# EAGLE design Motor_Driver (EAGLE 9.5.2)
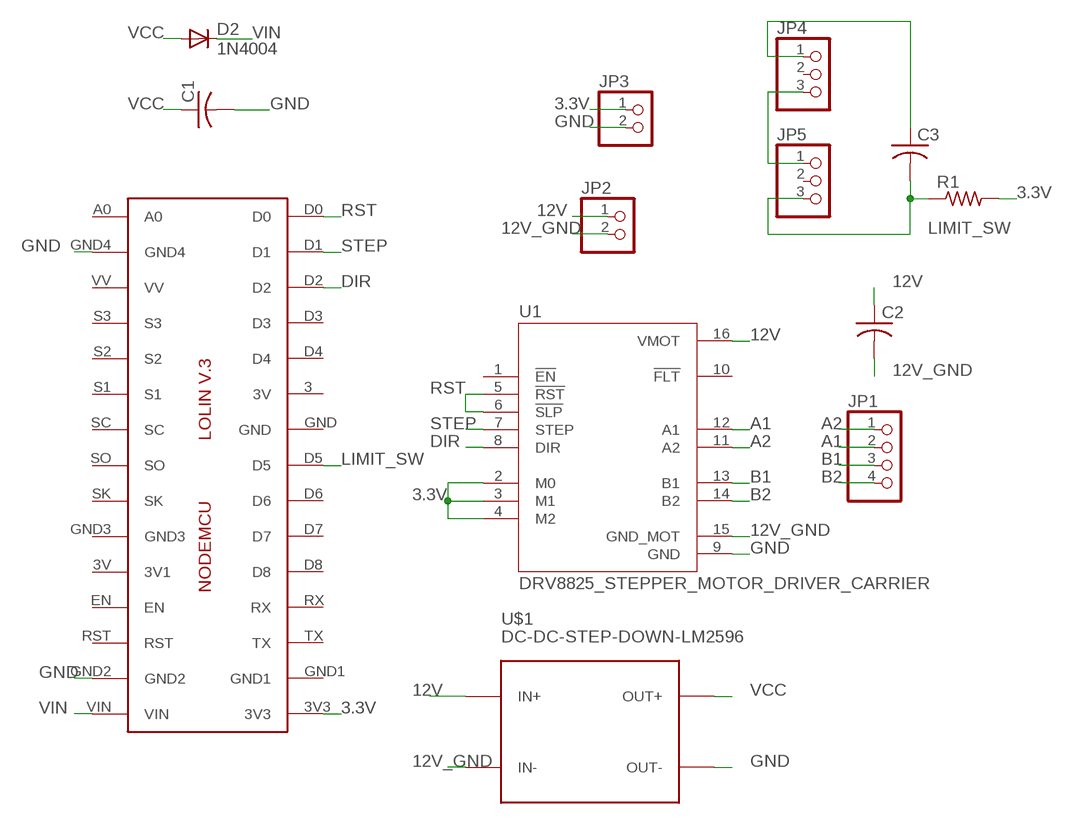
[diagram p0: schematic, sheet 1]

## Parts
C1  C-US025-040X050  [C025-040X050]
C2  C-US050-035X075  [C050-035X075]
C3  C-US050-035X075  [C050-035X075]
D2  1N4004  [DO41-10]
IC1  LOLINV3  [LOLINV3]
JP1  PINHD-1X4  [1X04]
JP2  PINHD-1X2  [1X02]
JP3  PINHD-1X2  [1X02]
JP4  PINHD-1X3CB  [1X03-CLEANBIG]
JP5  PINHD-1X3CB  [1X03-CLEANBIG]
R1  R-US_V234/12  [V234/12]
U1  DRV8825_STEPPER_MOTOR_DRIVER_CARRIER  [IC_DRV8825_STEPPER_MOTOR_DRIVER_CARRIER]
U$1  DC-DC-STEP-DOWN-LM2596  [DC-DC-STEP-DOWN-LM2596]

## Nets
3.3V: IC1.3V3 JP3.1 R1.2 U1.2(M0) U1.3(M1) U1.4(M2)
12V: C2.1 JP2.1 U1.16(VMOT) U$1.IN+
12V_GND: C2.2 JP2.2 U1.15(GND_MOT) U$1.IN-
A1: JP1.2 U1.12(A1)
A2: JP1.1 U1.11(A2)
B1: JP1.3 U1.13(B1)
B2: JP1.4 U1.14(B2)
DIR: IC1.D2 U1.8(DIR)
GND: C1.2 IC1.GND2 IC1.GND4 JP3.2 U1.9(GND) U$1.OUT-
LIMIT_SW: C3.2 IC1.D5 JP5.3 R1.1
N$1: JP4.3 JP5.1
N$2: C3.1 JP4.1
RST: IC1.D0 U1.5(!RST) U1.6(!SLP)
STEP: IC1.D1 U1.7(STEP)
VCC: C1.1 D2.A U$1.OUT+
VIN: D2.C IC1.VIN
Unconnected: IC1.3(3V) IC1.3V(3V1) IC1.A0 IC1.D3 IC1.D4 IC1.D6 IC1.D7 IC1.D8 IC1.EN IC1.GND IC1.GND1 IC1.GND3 IC1.RST IC1.RX IC1.S1 IC1.S2 IC1.S3 IC1.SC IC1.SK IC1.SO IC1.TX IC1.VV JP4.2 JP5.2 U1.1(!EN) U1.10(!FLT)

## Library data of the parts
C1-C3 = adafruit:C-US: CAPACITOR, American symbol
D2 = adafruit:1N4004: DIODE General purpose 1N400x type rectifier (With bigger pads) http://www.ladyada.net/library/pcb/eaglelibrary.html
IC1 = Lolin:LOLINV3
JP1 = pinhead:PINHD-1X4: PIN HEADER
JP2 JP3 = pinhead:PINHD-1X2: PIN HEADER
JP4 JP5 = adafruit:PINHD-1X3: PIN HEADER
R1 = adafruit:R-US_: RESISTOR, American symbol
U1 = DRV8825:DRV8825_STEPPER_MOTOR_DRIVER_CARRIER: Stepper motor controler; IC: DRV8825; 1.5A; Uin mot: 8.2÷45V; AVAILABILITY: Unavailable; DESCRIPTION: DRV8825 Motor Controller/Driver Power Management Evaluation Board; MF: Pololu; MP: DRV8825 STEPPER MOTOR DRIVER CARRIER; PACKAGE: None; PRICE: None
U$1 = diy-modules:DC-DC-STEP-DOWN-LM2596: DC/DC Step-Down Regulator based on LM2596-ADJ chip LM2596 datasheet available here: http://www.ti.com/lit/ds/symlink/lm2596.pdf Click here to find device on ebay.com <http://www.ebay.com/sch/lm2596+power+regulator>

## Board
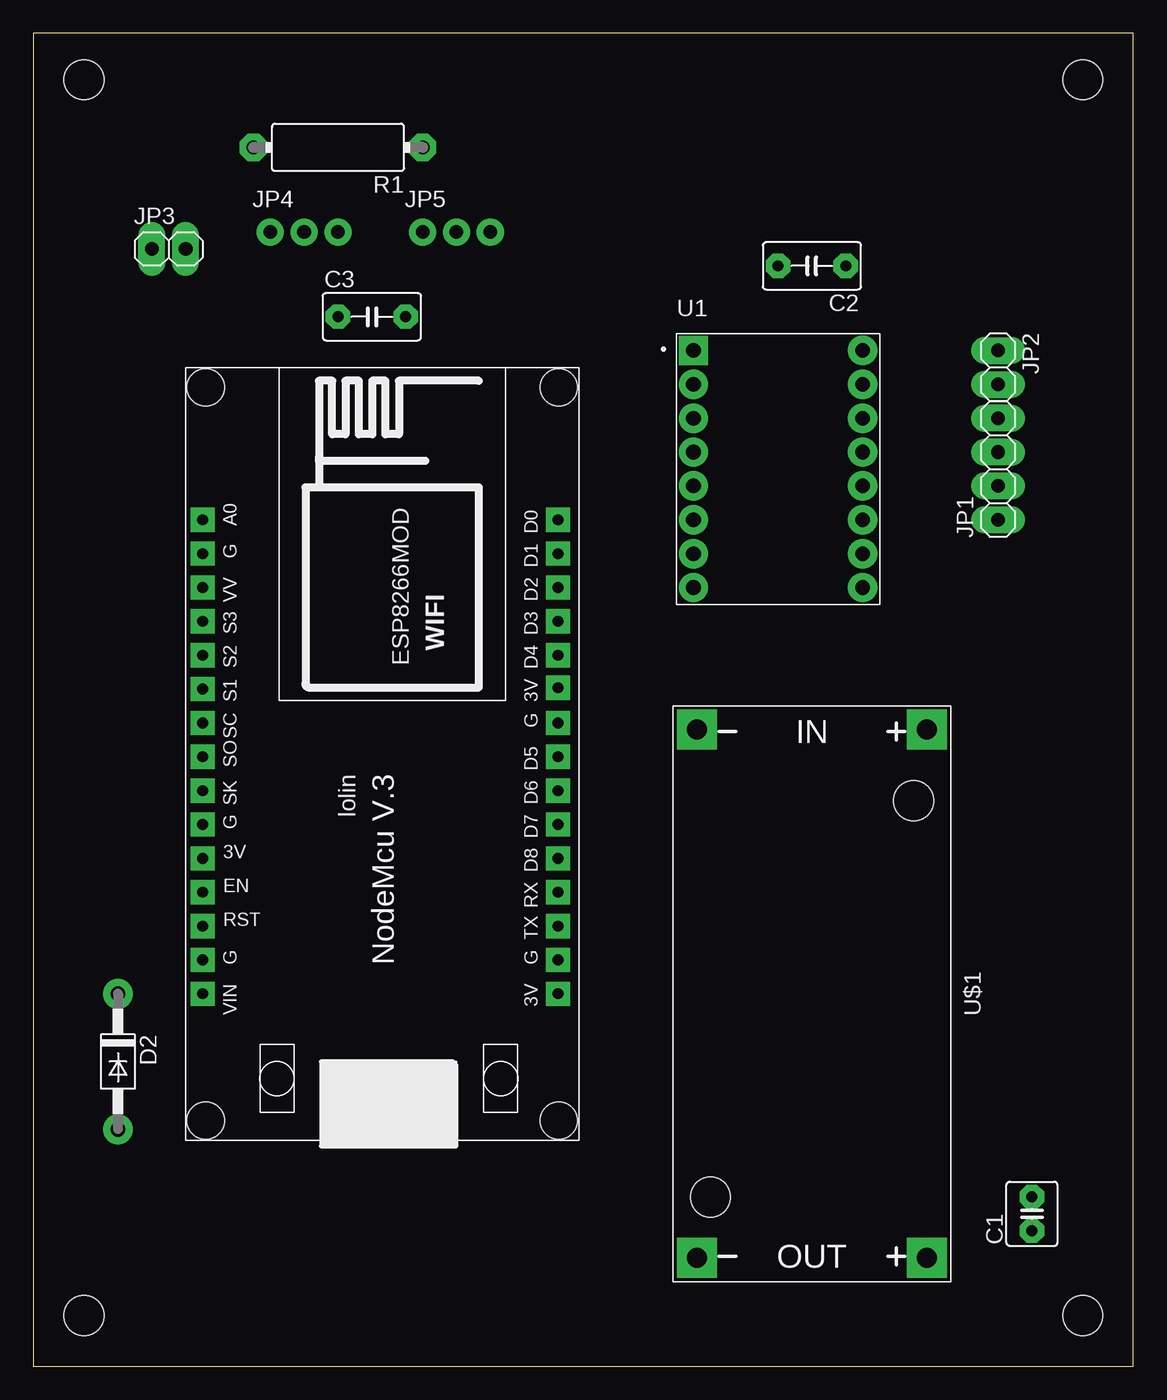
[diagram p1: board, top side]
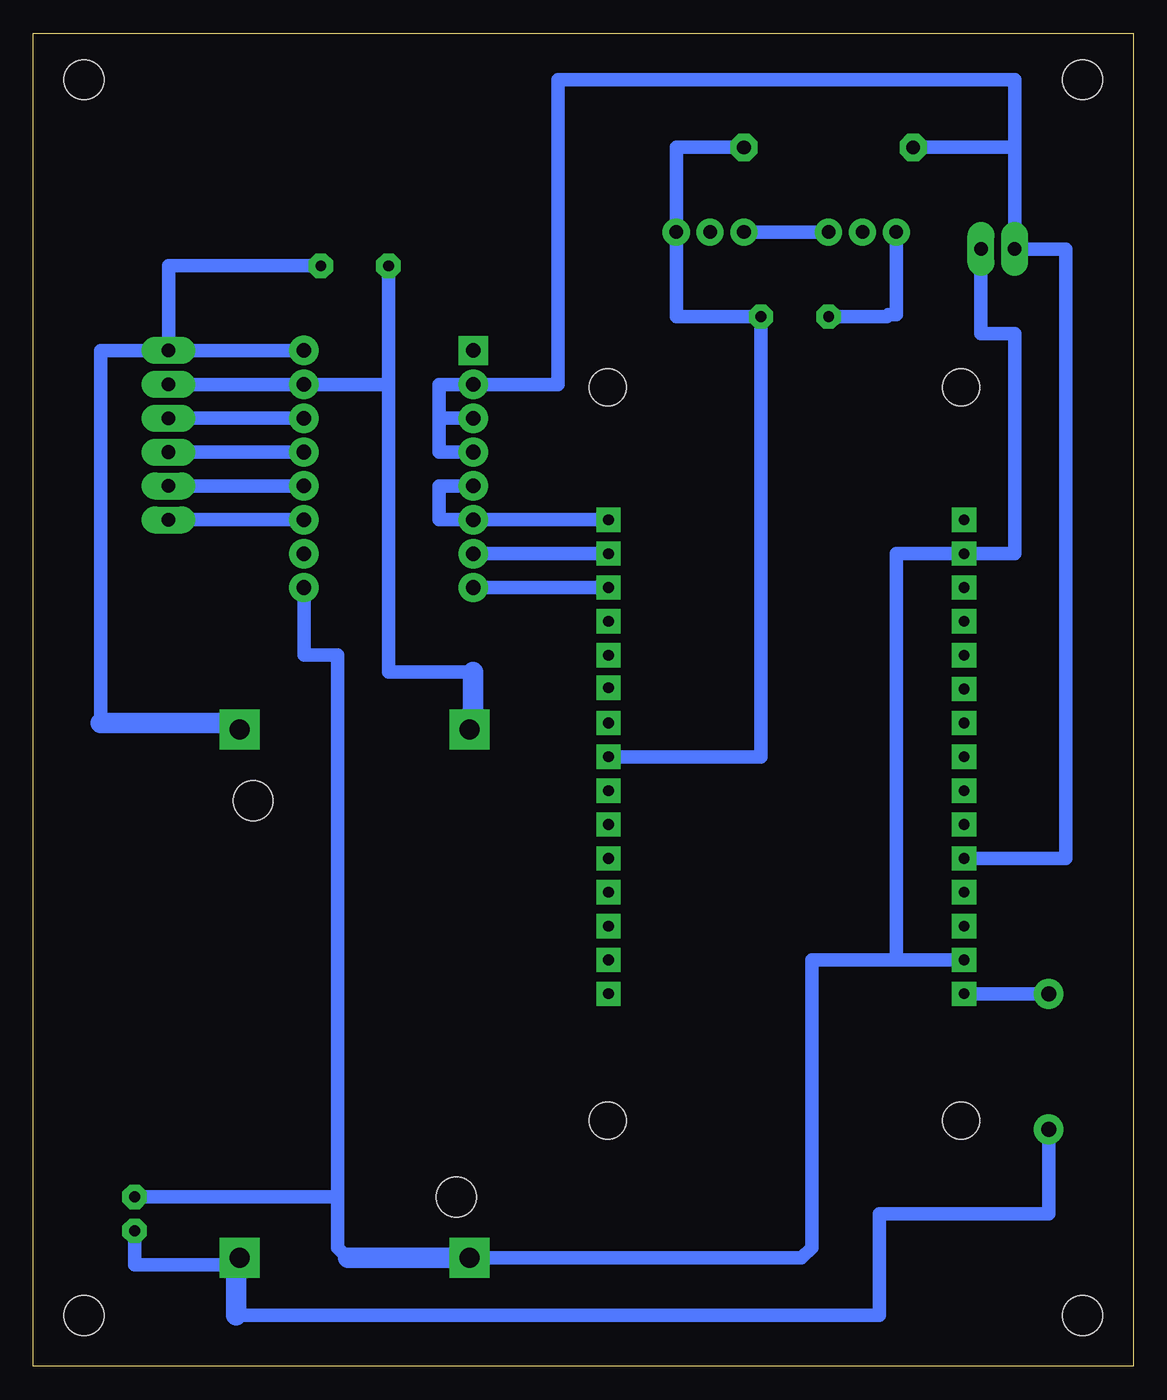
[diagram p2: board, bottom side, seen from below]

Size 82.53 x 100 mm. Coordinates in mm from the lower left corner, seen from the top.
Outline: 0,0 82.53,0 82.53,100 0,100 0,0
Copper layers (1*16): Top 0.035mm / dielectric 1.5mm / Bottom 0.035mm
Design rules "Old": minimum track width 1mm, minimum drill 1mm, track to track 16mil, track to pad 16mil, pad to pad 16mil, via to via 16mil, smd to smd 6mil, copper to edge 30mil, drill to drill 6mil, minimum pad ring 20mil, minimum via ring 8mil, stop-mask expansion 4mil, vias tented up to drill 0mil, thermal gap 10mil
Holes 3 mm at 3.81,96.52 78.74,96.52 3.81,3.81 78.74,3.81

### Footprints (pad centres in the part's own frame; a part is rotated, then mirrored left to right if it is on the bottom)
C025-040X050 = drill 0.813 pad 1.422 octagon: 1 -1.27,0; 2 1.27,0
C050-035X075 = drill 0.813 octagon: 1 -2.54,0; 2 2.54,0
DO41-10 = drill 1.118 pad 1.93: A 5.08,0; C -5.08,0
LOLINV3 = drill 0.8 pad 1.778 square: 3 24.03,27.94; 3V 46.99,27.94; 3V3 36.83,1.27; A0 11.43,1.27; D0 11.43,27.94; D1 13.97,27.94; D2 16.51,27.94; D3 19.05,27.94; D4 21.59,27.94; D5 29.21,27.94; D6 31.75,27.94; D7 34.29,27.94; D8 36.83,27.94; EN 39.37,1.27; GND 26.67,27.94; GND1 44.45,27.94; GND2 44.45,1.27; GND3 34.29,1.27; GND4 13.97,1.27; RST 41.91,1.27; RX 39.37,27.94; S1 24.13,1.27; S2 21.59,1.27; S3 19.05,1.27; SC 26.67,1.27; SK 31.75,1.27; SO 29.21,1.27; TX 41.91,27.94; VIN 46.99,1.27; VV 16.51,1.27 | hole 2.8: 56.5,28; 56.5,1.5; 1.5,1.5; 1.5,28
1X04 = drill 1.016 long: 1 -3.81,0; 2 -1.27,0; 3 1.27,0; 4 3.81,0
1X02 = drill 1.016 long: 1 -1.27,0; 2 1.27,0
1X03-CLEANBIG = drill 1.016 pad 1.676: 1 -2.54,0; 2 0,0; 3 2.54,0
V234/12 = drill 1.016 octagon: 1 -6.35,0; 2 6.35,0
IC_DRV8825_STEPPER_MOTOR_DRIVER_CARRIER = drill 1.1 square: 1 -6.35,8.89 | drill 1.1: 2 -6.35,6.35; 3 -6.35,3.81; 4 -6.35,1.27; 5 -6.35,-1.27; 6 -6.35,-3.81; 7 -6.35,-6.35; 8 -6.35,-8.89; 9 6.35,-8.89; 10 6.35,-6.35; 11 6.35,-3.81; 12 6.35,-1.27; 13 6.35,1.27; 14 6.35,3.81; 15 6.35,6.35; 16 6.35,8.89
DC-DC-STEP-DOWN-LM2596 = drill 1.5 pad 2.5 square: IN+ -19.812,8.636; IN- -19.812,-8.636; OUT+ 19.812,8.636; OUT- 19.812,-8.636 | hole 3: -14.478,7.62; 15.24,-7.62

### Placement (x,y rotation side)
C1  74.93,11.43 90 top
C2  58.42,82.55 180 top
C3  25.4,78.74 0 top
D2  6.35,22.86 270 top
IC1  11.43,74.93 270 top
JP1  72.39,67.31 90 top
JP2  72.39,74.93 270 top
JP3  10.16,83.82 0 top
JP4  20.32,85.09 0 top
JP5  31.75,85.09 0 top
R1  22.86,91.44 180 top
U1  55.88,67.31 0 top
U$1  58.42,27.94 270 top

### Tracks (layer width: path | path; a pad name or v marks a point on that pad's centre or on a via)
3.3V
  Bottom 1: 52.07,71.12 52.07,73.66 U1.2 43.18,73.66 43.18,96.52 8.89,96.52 8.89,91.44 | 52.07,71.12 U1.3 | 52.07,71.12 52.07,68.58 U1.4 | IC1.3V3 5.08,38.1 5.08,83.82 JP3.1 8.89,91.44 | 8.89,91.44 R1.2
12V
  Bottom 1: U1.16 JP2.1 | C2.1 72.39,82.55 JP2.1 | JP2.1 77.47,76.2 77.47,48.26 | U$1.IN+ 67.56,48.26
  Bottom 1.524: 67.56,48.26 77.47,48.26
12V_GND
  Bottom 1: JP2.2 U1.15 55.88,73.66 | U$1.IN- 49.53,48.01 | 49.53,52.07 55.88,52.07 55.88,73.66 | 55.88,73.66 C2.2
  Bottom 1.524: 49.53,48.01 49.53,52.07
A1
  Bottom 1: U1.12 JP1.2
A2
  Bottom 1: U1.11 JP1.1
B1
  Bottom 1: U1.13 JP1.3
B2
  Bottom 1: U1.14 JP1.4
DIR
  Bottom 1: IC1.D2 U1.8
GND
  Bottom 1: U1.9 62.23,53.34 59.69,53.34 59.69,12.7 | 59.69,12.7 59.69,8.89 58.93,8.13 | C1.2 59.69,12.7 | IC1.GND2 17.78,30.48 | 17.78,30.48 24.13,30.48 24.13,8.89 24.89,8.13 U$1.OUT- | 17.78,30.48 17.78,60.96 IC1.GND4 8.89,60.96 8.89,77.47 11.43,77.47 JP3.2
  Bottom 1.524: 58.93,8.13 U$1.OUT-
LIMIT_SW
  Bottom 1: R1.1 34.29,91.44 JP5.3 34.29,78.74 C3.2 27.94,45.72 IC1.D5
N$1
  Bottom 1: JP5.1 JP4.3
N$2
  Bottom 1: JP4.1 17.78,78.88 18.36,78.88 18.5,78.74 C3.1
RST
  Bottom 1: IC1.D0 U1.6 52.07,63.5 52.07,66.04 U1.5
STEP
  Bottom 1: IC1.D1 U1.7
VCC
  Bottom 1: 67.31,3.81 19.05,3.81 19.05,11.43 6.35,11.43 D2.A | 67.31,7.87 U$1.OUT+ 67.56,7.62 74.93,7.62 C1.1
  Bottom 1.524: 67.31,3.81 67.31,7.87
VIN
  Bottom 1: D2.C IC1.VIN